# Altium schematic sheet Leds.SchDoc: Leds
size A4; Author: Joao Guimaraes; Organization: Altium Limited; Address1: L3, 12a Rodborough Rd; Address2: Frenchs Forest; Address3: NSW; Address4: Australia 2086; Revision: 1.0.0
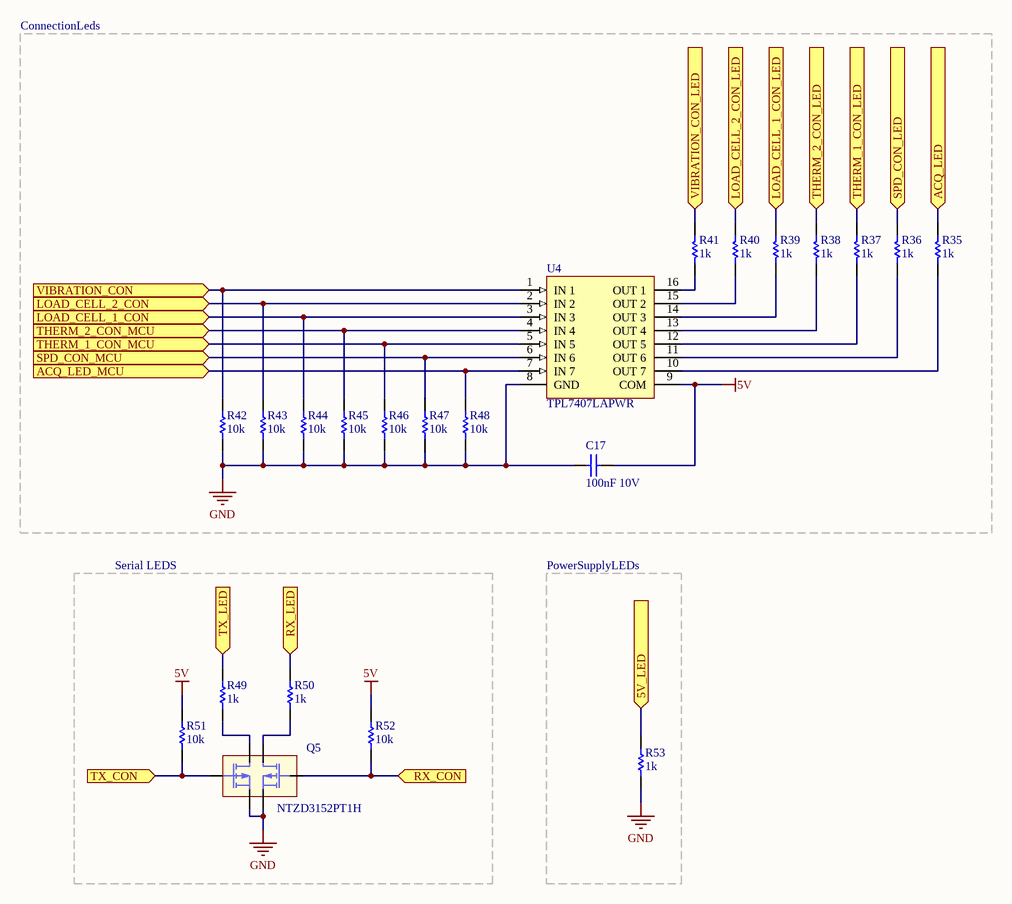
[diagram p0: Leds.SchDoc]

## Parts
C17  100nF 10V  [0402]
Q5  NTZD3152PT1H  [SOT23-6_M]
R35  1k  [6-0805_M]
R36  1k  [6-0805_M]
R37  1k  [6-0805_M]
R38  1k  [6-0805_M]
R39  1k  [6-0805_M]
R40  1k  [6-0805_M]
R41  1k  [6-0805_M]
R42  10k  [6-0805_M]
R43  10k  [6-0805_M]
R44  10k  [6-0805_M]
R45  10k  [6-0805_M]
R46  10k  [6-0805_M]
R47  10k  [6-0805_M]
R48  10k  [6-0805_M]
R49  1k  [6-0805_M]
R50  1k  [6-0805_M]
R51  10k  [6-0805_M]
R52  10k  [6-0805_M]
R53  1k  [6-0805_M]
U4  TPL7407LAPWR  [TSOP-16]

## Blocks framed on the sheet
ConnectionLeds: C17 R35-R48 U4
Serial LEDS: Q5 R49-R52
PowerSupplyLEDs: R53

## Ports
5V_LED (in), ACQ_LED (in), ACQ_LED_MCU (in), LOAD_CELL_1_CON (in), LOAD_CELL_1_CON_LED (in), LOAD_CELL_2_CON (in), LOAD_CELL_2_CON_LED (in), RX_CON (in), RX_LED (in), SPD_CON_LED (in), SPD_CON_MCU (in), THERM_1_CON_LED (in), THERM_1_CON_MCU (in), THERM_2_CON_LED (in), THERM_2_CON_MCU (in), TX_CON (in), TX_LED (in), VIBRATION_CON (in), VIBRATION_CON_LED (in)

## Nets
5V: C17.2 R51.2 R52.2 U4.9(COM)
GND: C17.1 Q5.1(S1) Q5.4(S2) R42.1 R43.1 R44.1 R45.1 R46.1 R47.1 R48.1 R53.1 U4.8(GND)
5V_LED: R53.2 ; port 5V_LED
ACQ_LED: R35.2 ; port ACQ_LED
ACQ_LED_MCU: R48.2 U4.7(IN_7) ; port ACQ_LED_MCU
LOAD_CELL_1_CON: R44.2 U4.3(IN_3) ; port LOAD_CELL_1_CON
LOAD_CELL_1_CON_LED: R39.2 ; port LOAD_CELL_1_CON_LED
LOAD_CELL_2_CON: R43.2 U4.2(IN_2) ; port LOAD_CELL_2_CON
LOAD_CELL_2_CON_LED: R40.2 ; port LOAD_CELL_2_CON_LED
RX_CON: Q5.5(G2) R52.1 ; port RX_CON
RX_LED: R50.2 ; port RX_LED
SPD_CON_LED: R36.2 ; port SPD_CON_LED
SPD_CON_MCU: R47.2 U4.6(IN_6) ; port SPD_CON_MCU
THERM_1_CON_LED: R37.2 ; port THERM_1_CON_LED
THERM_1_CON_MCU: R46.2 U4.5(IN_5) ; port THERM_1_CON_MCU
THERM_2_CON_LED: R38.2 ; port THERM_2_CON_LED
THERM_2_CON_MCU: R45.2 U4.4(IN_4) ; port THERM_2_CON_MCU
TX_CON: Q5.2(G1) R51.1 ; port TX_CON
TX_LED: R49.2 ; port TX_LED
VIBRATION_CON: R42.2 U4.1(IN_1) ; port VIBRATION_CON
VIBRATION_CON_LED: R41.2 ; port VIBRATION_CON_LED
NetQ5_3: Q5.3(D2) R50.1
NetQ5_6: Q5.6(D1) R49.1
NetR35_1: R35.1 U4.10(OUT_7)
NetR36_1: R36.1 U4.11(OUT_6)
NetR37_1: R37.1 U4.12(OUT_5)
NetR38_1: R38.1 U4.13(OUT_4)
NetR39_1: R39.1 U4.14(OUT_3)
NetR40_1: R40.1 U4.15(OUT_2)
NetR41_1: R41.1 U4.16(OUT_1)

## Notes on the sheet
- Title:
- Project:
- Date:
- Author:
- Version:
- File:

## Library data of the parts
C17 = Cap: Capacitor; PartNumber: CAP.100n.10V.20%.SMD.0402; Manufacturer: Wurth; ClassName: Leds; Price: 0.015; Supplier: Mouser
Q5 = NTZD3152PT1H: −20 V, −430 mA, Dual P−Channel with ESD Protection, SOT−563; PartNumber: NTZD315PT1H; Manufacturer: ON Semiconductor; ClassName: Leds; Price: 0.35; Supplier: Mouser
R35-R41 R49 R50 R53 = Res: Resistor; PartNumber: RES.1K.1/8W.5%.SMD.0805; Manufacturer: Yageo; ClassName: Leds; Price: 0.012; Supplier: Mouser
R42-R48 R51 R52 = Res: Resistor; PartNumber: RES.10K.1/8W.5%.SMD.0805; Manufacturer: Yageo; ClassName: Leds; Price: 0.012; Supplier: Mouser
U4 = TPL7407LAPWR: Manufacturer: TL2575-05; ClassName: Leds; PartNumber: TPL7407LAPWR; Price: 0.64; Supplier: Mouser